# Altium project 接口板.PrjPCB
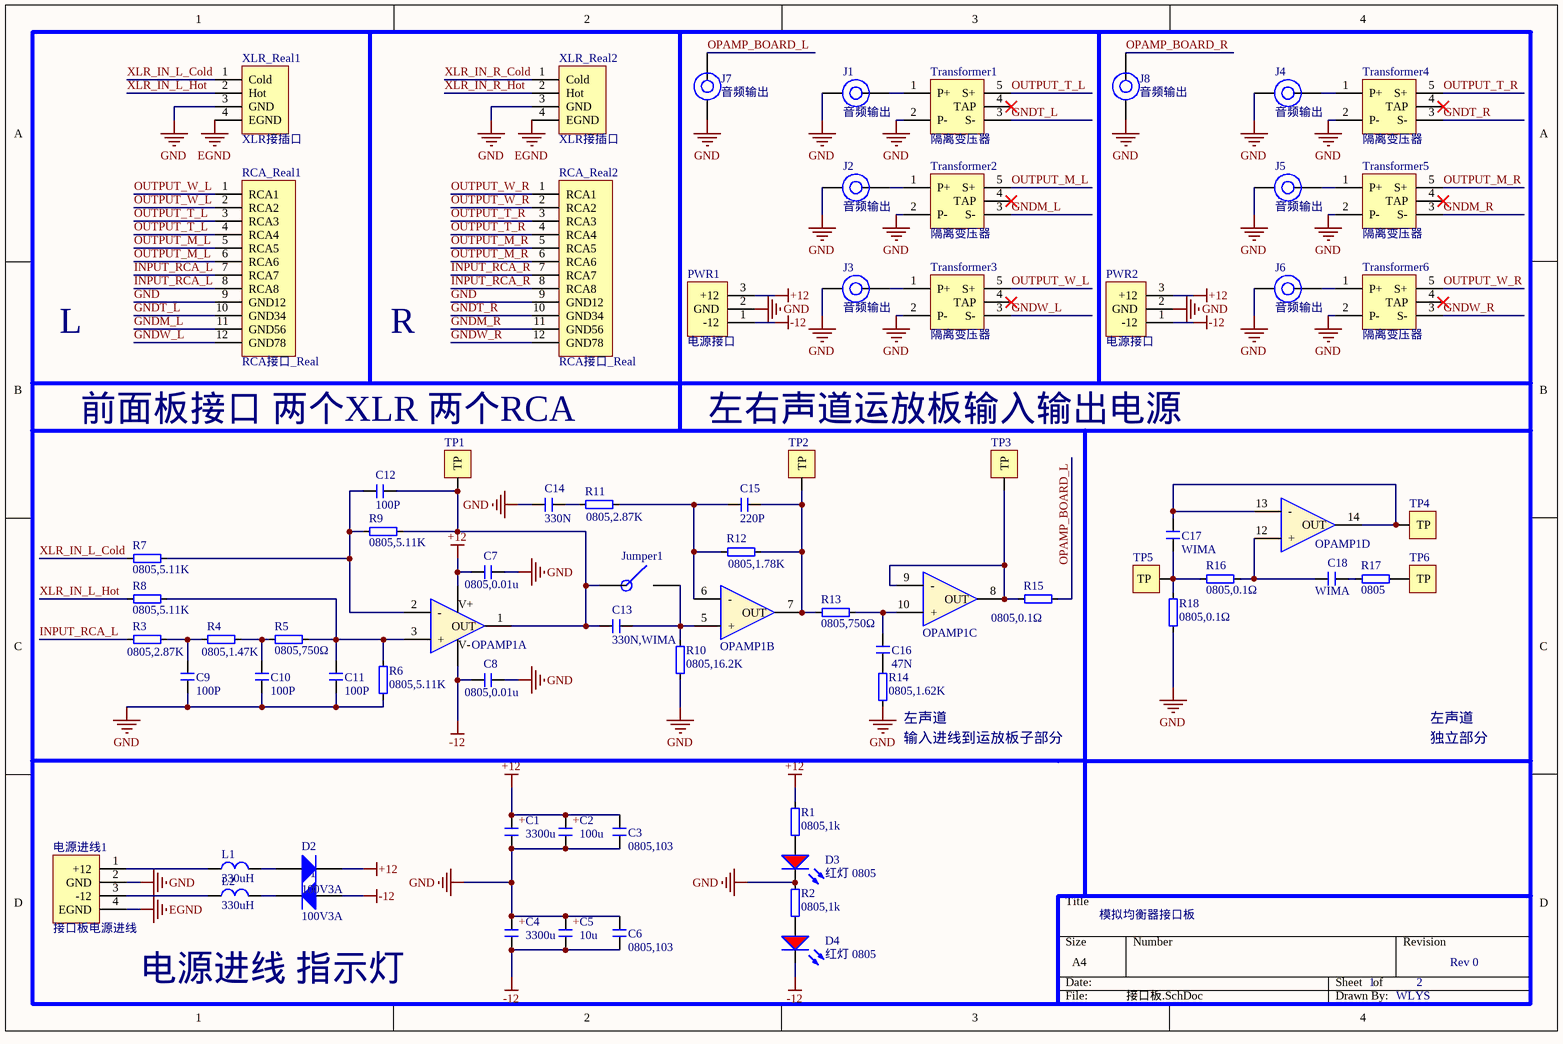
[diagram p0: 接口板.SchDoc]
2 sheets, 107 parts. Net scope: global (net labels, ports and power ports of the same name join across sheets).
Board file: 接口板.PcbDoc
Sheets:
  接口板.SchDoc
  接口板2.SchDoc

## Sheet 接口板.SchDoc
size A4

### Parts
C1  3300u  [CAP 7.5*16*31.5 - BK]
C2  100u  [CAP 2.5*6.3*11.2]
C3  0805,103  [0805_C]
C4  3300u  [CAP 7.5*16*31.5 - BK]
C5  10u  [CAP 2.5*6.3*11.2]
C6  0805,103  [0805_C]
C7  0805,0.01u  [0805_C]
C8  0805,0.01u  [0805_C]
C9  100P  [WIMA_5mm]
C10  100P  [WIMA_5mm]
C11  100P  [WIMA_5mm]
C12  100P  [WIMA_5mm]
C13  330N,WIMA  [WIMA_5mmPin*10mmL]
C14  330N  [WIMA_5mmPin*10mmL]
C15  220P  [WIMA_5mm]
C16  47N  [WIMA_5mm]
C17  WIMA  [WIMA_5mm]
C18  WIMA  [WIMA_5mm]
D1  100V3A  [DO-201AD]
D2  100V3A  [DO-201AD]
D3  红灯 0805  [0805_LED_S3]
D4  红灯 0805  [0805_LED_S3]
J1  音频输出  [XH2.54-LI-2P]
J2  音频输出  [XH2.54-LI-2P]
J3  音频输出  [XH2.54-LI-2P]
J4  音频输出  [XH2.54-LI-2P]
J5  音频输出  [XH2.54-LI-2P]
J6  音频输出  [XH2.54-LI-2P]
J7  音频输出  [XH2.54-LI-2P]
J8  音频输出  [XH2.54-LI-2P]
Jumper1  Jumper  [0805_J]  (value not drawn)
L1  330uH  [Inductor]
L2  330uH  [Inductor]
OPAMP1  4277UA  [SOIC-14_150mil]  (value not drawn)  (parts A,B,C,D of 4)
PWR1  电源接口  [XH2.54-LI-3P]
PWR2  电源接口  [XH2.54-LI-3P]
R1  0805,1k  [0805_R]
R2  0805,1k  [0805_R]
R3  0805,2.87K  [0805_R]
R4  0805,1.47K  [0805_R]
R5  0805,750Ω  [0805_R]
R6  0805,5.11K  [0805_R]
R7  0805,5.11K  [0805_R]
R8  0805,5.11K  [0805_R]
R9  0805,5.11K  [0805_R]
R10  0805,16.2K  [0805_R]
R11  0805,2.87K  [0805_R]
R12  0805,1.78K  [0805_R]
R13  0805,750Ω  [0805_R]
R14  0805,1.62K  [0805_R]
R15  0805,0.1Ω  [0805_R]
R16  0805,0.1Ω  [0805_R]
R17  0805  [0805_R]
R18  0805,0.1Ω  [0805_R]
RCA_Real1  RCA接口_Real  [RCA_Real]
RCA_Real2  RCA接口_Real  [RCA_Real]
TP1  测试点  [TestPoint]  (value not drawn)
TP2  测试点  [TestPoint]  (value not drawn)
TP3  测试点  [TestPoint]  (value not drawn)
TP4  测试点  [TestPoint]  (value not drawn)
TP5  测试点  [TestPoint]  (value not drawn)
TP6  测试点  [TestPoint]  (value not drawn)
Transformer1  隔离变压器  [Transformer]
Transformer2  隔离变压器  [Transformer]
Transformer3  隔离变压器  [Transformer]
Transformer4  隔离变压器  [Transformer]
Transformer5  隔离变压器  [Transformer]
Transformer6  隔离变压器  [Transformer]
XLR_Real1  XLR接插口  [XLR_Real]
XLR_Real2  XLR接插口  [XLR_Real]
电源进线1  接口板电源进线  [AC_Adaptor_Input]

### Nets
+12: C1.1 C2.1 C3.1 C7.1 D2.2(K) OPAMP1.4(V+) PWR1.3(+12) PWR2.3(+12) R1.2
-12: C4.2 C5.2 C6.2 C8.1 D1.1(A) D4.K OPAMP1.11(V-) PWR1.1(-12) PWR2.1(-12)
EGND: XLR_Real1.4(EGND) XLR_Real2.4(EGND) 电源进线1.4(EGND)
GND: C1.2 C2.2 C3.2 C4.1 C5.1 C6.1 C7.2 C8.2 C9.2 C10.2 C11.2 C14.1 D3.K J1.2(GND) J2.2(GND) J3.2(GND) J4.2(GND) J5.2(GND) J6.2(GND) J7.2(GND) J8.2(GND) PWR1.2(GND) PWR2.2(GND) R2.2 R6.1 R10.1 R14.1 R18.2 RCA_Real1.9(GND12) RCA_Real2.9(GND12) Transformer1.2(P-) Transformer2.2(P-) Transformer3.2(P-) Transformer4.2(P-) Transformer5.2(P-) Transformer6.2(P-) XLR_Real1.3(GND) XLR_Real2.3(GND) 电源进线1.2(GND)
GNDM_L: RCA_Real1.11(GND56) Transformer2.3(S-)
GNDM_R: RCA_Real2.11(GND56) Transformer5.3(S-)
GNDT_L: RCA_Real1.10(GND34) Transformer1.3(S-)
GNDT_R: RCA_Real2.10(GND34) Transformer4.3(S-)
GNDW_L: RCA_Real1.12(GND78) Transformer3.3(S-)
GNDW_R: RCA_Real2.12(GND78) Transformer6.3(S-)
INPUT_RCA_L: R3.1 RCA_Real1.7(RCA7) RCA_Real1.8(RCA8)
INPUT_RCA_R: RCA_Real2.7(RCA7) RCA_Real2.8(RCA8)
OPAMP_BOARD_L: J7.1(MIC) R15.2
OPAMP_BOARD_R: J8.1(MIC)
OUTPUT_M_L: RCA_Real1.5(RCA5) RCA_Real1.6(RCA6) Transformer2.5(S+)
OUTPUT_M_R: RCA_Real2.5(RCA5) RCA_Real2.6(RCA6) Transformer5.5(S+)
OUTPUT_T_L: RCA_Real1.3(RCA3) RCA_Real1.4(RCA4) Transformer1.5(S+)
OUTPUT_T_R: RCA_Real2.3(RCA3) RCA_Real2.4(RCA4) Transformer4.5(S+)
OUTPUT_W_L: RCA_Real1.1(RCA1) RCA_Real1.2(RCA2) Transformer3.5(S+)
OUTPUT_W_R: RCA_Real2.1(RCA1) RCA_Real2.2(RCA2) Transformer6.5(S+)
XLR_IN_L_Cold: R7.2 XLR_Real1.1(Cold)
XLR_IN_L_Hot: R8.2 XLR_Real1.2(Hot)
XLR_IN_R_Cold: XLR_Real2.1(Cold)
XLR_IN_R_Hot: XLR_Real2.2(Hot)
NetC9_1: C9.1 R3.2 R4.1
NetC10_1: C10.1 R4.2 R5.1
NetC11_1: C11.1 OPAMP1.3(+) R5.2 R6.2 R8.1
NetC12_1: C12.1 OPAMP1.2(-) R7.1 R9.1
NetC12_2: C12.2 C13.1 Jumper1.1 OPAMP1.1(OUT) R9.2 TP1.1(TP)
NetC13_2: C13.2 Jumper1.2 OPAMP1.5(+) R10.2
NetC14_2: C14.2 R11.1
NetC15_1: C15.1 OPAMP1.6(-) R11.2 R12.1
NetC15_2: C15.2 OPAMP1.7(OUT) R12.2 R13.1 TP2.1(TP)
NetC16_1: C16.1 OPAMP1.10(+) R13.2
NetC16_2: C16.2 R14.2
NetC17_1: C17.1 OPAMP1.13(-) OPAMP1.14(OUT) TP4.1(TP)
NetC17_2: C17.2 R16.2 R18.1 TP5.1(TP)
NetC18_1: C18.1 OPAMP1.12(+) R16.1
NetC18_2: C18.2 R17.2
NetD1_2: D1.2(K) L2.2
NetD2_1: D2.1(A) L1.2
NetD3_A: D3.A R1.1
NetD4_A: D4.A R2.1
NetJ1_1: J1.1(MIC) Transformer1.1(P+)
NetJ2_1: J2.1(MIC) Transformer2.1(P+)
NetJ3_1: J3.1(MIC) Transformer3.1(P+)
NetJ4_1: J4.1(MIC) Transformer4.1(P+)
NetJ5_1: J5.1(MIC) Transformer5.1(P+)
NetJ6_1: J6.1(MIC) Transformer6.1(P+)
NetL1_1: L1.1 电源进线1.1(+12)
NetL2_1: L2.1 电源进线1.3(-12)
NetOPAMP1_8: OPAMP1.8(OUT) OPAMP1.9(-) R15.1 TP3.1(TP)
NetR17_1: R17.1 TP6.1(TP)

Not connected (* = marked no-connect by the designer): Transformer1 4(TAP)*; Transformer2 4(TAP)*; Transformer3 4(TAP)*; Transformer4 4(TAP)*; Transformer5 4(TAP)*; Transformer6 4(TAP)*

### Notes on the sheet
- L
- R
- 前面板接口 两个XLR 两个RCA
- 左右声道运放板输入输出电源
- (near R14) 输入进线到运放板子部分
- (near R14) 左声道
- 独立部分
- 左声道
- 模拟均衡器接口板
- 电源进线 指示灯
- 1
- 2
- Rev 0
- WLYS
- (in symbol C直插电解) +

### Library data of the parts
C1 C2 C4 C5 = C直插电解
C3 C6-C8 = C0805
C9-C12 C17 C18 = WIMA_CAP_100P
C13 C14 = WIMA_CAP_330N
C15 = WIMA_CAP_220P
C16 = WIMA_CAP_47N
D1 D2 = 1N5401
D3 D4 = 0805 红灯: 发光二极管; ComponentLink1Description: 供应商链接; ComponentLink1URL: http://www.szlcsc.com/product/details_2668.html; Package: 0805; Supplier: LC; SuppliersPartNumber: C2295
L1 L2 = 直插裸体电感330uH
OPAMP1 = OPA4277UA
R1-R18 = R0805
XLR_Real1 XLR_Real2 = XLR接口_Real

## Sheet 接口板2.SchDoc
size A4
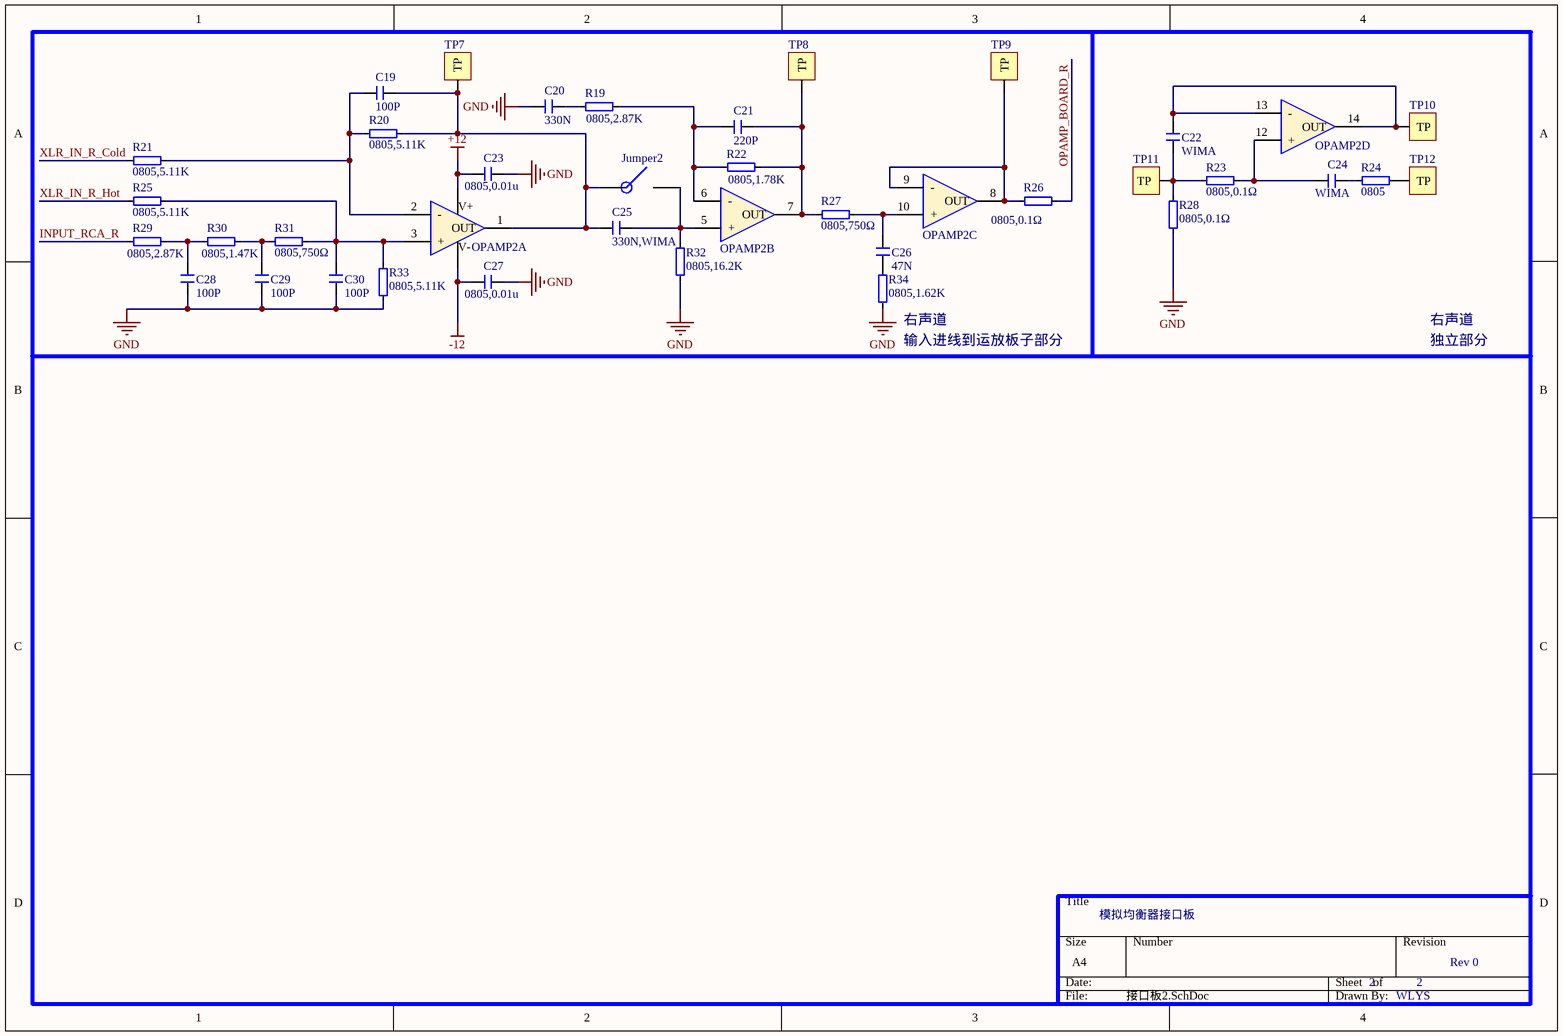
[diagram p1: 接口板2.SchDoc]

### Parts
C19  100P  [WIMA_5mm]
C20  330N  [WIMA_5mmPin*10mmL]
C21  220P  [WIMA_5mm]
C22  WIMA  [WIMA_5mm]
C23  0805,0.01u  [0805_C]
C24  WIMA  [WIMA_5mm]
C25  330N,WIMA  [WIMA_5mmPin*10mmL]
C26  47N  [WIMA_5mm]
C27  0805,0.01u  [0805_C]
C28  100P  [WIMA_5mm]
C29  100P  [WIMA_5mm]
C30  100P  [WIMA_5mm]
Jumper2  Jumper  [0805_J]  (value not drawn)
OPAMP2  4277UA  [SOIC-14_150mil]  (value not drawn)  (parts A,B,C,D of 4)
R19  0805,2.87K  [0805_R]
R20  0805,5.11K  [0805_R]
R21  0805,5.11K  [0805_R]
R22  0805,1.78K  [0805_R]
R23  0805,0.1Ω  [0805_R]
R24  0805  [0805_R]
R25  0805,5.11K  [0805_R]
R26  0805,0.1Ω  [0805_R]
R27  0805,750Ω  [0805_R]
R28  0805,0.1Ω  [0805_R]
R29  0805,2.87K  [0805_R]
R30  0805,1.47K  [0805_R]
R31  0805,750Ω  [0805_R]
R32  0805,16.2K  [0805_R]
R33  0805,5.11K  [0805_R]
R34  0805,1.62K  [0805_R]
TP7  测试点  [TestPoint]  (value not drawn)
TP8  测试点  [TestPoint]  (value not drawn)
TP9  测试点  [TestPoint]  (value not drawn)
TP10  测试点  [TestPoint]  (value not drawn)
TP11  测试点  [TestPoint]  (value not drawn)
TP12  测试点  [TestPoint]  (value not drawn)

### Nets
+12: C23.1 OPAMP2.4(V+)
-12: C27.1 OPAMP2.11(V-)
GND: C20.1 C23.2 C27.2 C28.2 C29.2 C30.2 R28.2 R32.1 R33.1 R34.1
INPUT_RCA_R: R29.1
OPAMP_BOARD_R: R26.2
XLR_IN_R_Cold: R21.2
XLR_IN_R_Hot: R25.2
NetC19_1: C19.1 OPAMP2.2(-) R20.1 R21.1
NetC19_2: C19.2 C25.1 Jumper2.1 OPAMP2.1(OUT) R20.2 TP7.1(TP)
NetC20_2: C20.2 R19.1
NetC21_1: C21.1 OPAMP2.6(-) R19.2 R22.1
NetC21_2: C21.2 OPAMP2.7(OUT) R22.2 R27.1 TP8.1(TP)
NetC22_1: C22.1 OPAMP2.13(-) OPAMP2.14(OUT) TP10.1(TP)
NetC22_2: C22.2 R23.2 R28.1 TP11.1(TP)
NetC24_1: C24.1 OPAMP2.12(+) R23.1
NetC24_2: C24.2 R24.2
NetC25_2: C25.2 Jumper2.2 OPAMP2.5(+) R32.2
NetC26_1: C26.1 OPAMP2.10(+) R27.2
NetC26_2: C26.2 R34.2
NetC28_1: C28.1 R29.2 R30.1
NetC29_1: C29.1 R30.2 R31.1
NetC30_1: C30.1 OPAMP2.3(+) R25.1 R31.2 R33.2
NetOPAMP2_8: OPAMP2.8(OUT) OPAMP2.9(-) R26.1 TP9.1(TP)
NetR24_1: R24.1 TP12.1(TP)

### Notes on the sheet
- (near R34) 输入进线到运放板子部分
- (near R34) 右声道
- 独立部分
- 右声道
- 模拟均衡器接口板
- 2
- Rev 0
- WLYS

### Library data of the parts
C19 C22 C24 C28-C30 = WIMA_CAP_100P
C20 C25 = WIMA_CAP_330N
C21 = WIMA_CAP_220P
C23 C27 = C0805
C26 = WIMA_CAP_47N
OPAMP2 = OPA4277UA
R19-R34 = R0805

## Nets that join several sheets
+12: 接口板 (9 pins), 接口板2 (C23.1 OPAMP2.4)
-12: 接口板 (9 pins), 接口板2 (C27.1 OPAMP2.11)
GND: 接口板 (39 pins), 接口板2 (10 pins)
INPUT_RCA_R: 接口板 (RCA_Real2.7 RCA_Real2.8), 接口板2 (R29.1)
OPAMP_BOARD_R: 接口板 (J8.1), 接口板2 (R26.2)
XLR_IN_R_Cold: 接口板 (XLR_Real2.1), 接口板2 (R21.2)
XLR_IN_R_Hot: 接口板 (XLR_Real2.2), 接口板2 (R25.2)